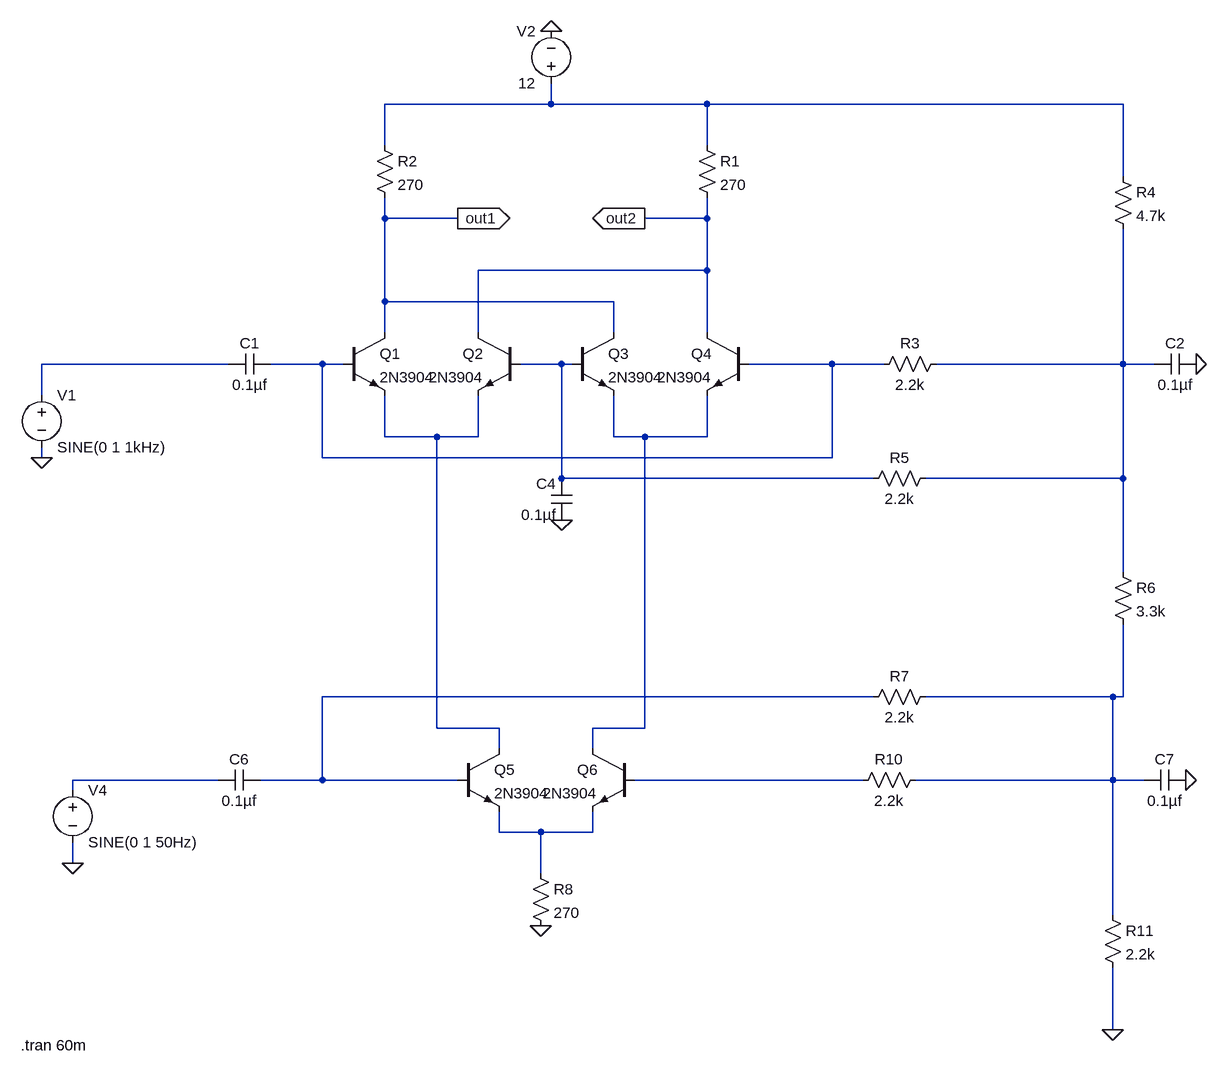
[diagram p0: schematic Day10_Gilbert_Cell_Multiplier.asc]
Day10_Gilbert_Cell_Multiplier.asc, the LTspice schematic file:
Version 4.1
SHEET 1 1396 1256
WIRE 384 -208 384 -240
WIRE 384 -208 128 -208
WIRE 624 -208 384 -208
WIRE 1264 -208 624 -208
WIRE 128 -144 128 -208
WIRE 624 -144 624 -208
WIRE 1264 -96 1264 -208
WIRE 128 -32 128 -64
WIRE 240 -32 128 -32
WIRE 624 -32 624 -64
WIRE 624 -32 528 -32
WIRE 624 48 624 -32
WIRE 624 48 272 48
WIRE 128 96 128 -32
WIRE 480 96 128 96
WIRE 128 144 128 96
WIRE 272 144 272 48
WIRE 480 144 480 96
WIRE 624 144 624 48
WIRE -112 192 -400 192
WIRE 32 192 -48 192
WIRE 64 192 32 192
WIRE 400 192 336 192
WIRE 416 192 400 192
WIRE 816 192 688 192
WIRE 896 192 816 192
WIRE 1264 192 1264 -16
WIRE 1264 192 976 192
WIRE 1312 192 1264 192
WIRE -400 240 -400 192
WIRE 128 304 128 240
WIRE 208 304 128 304
WIRE 272 304 272 240
WIRE 272 304 208 304
WIRE 480 304 480 240
WIRE 528 304 480 304
WIRE 624 304 624 240
WIRE 624 304 528 304
WIRE -400 336 -400 320
WIRE 32 336 32 192
WIRE 816 336 816 192
WIRE 816 336 32 336
WIRE 400 368 400 192
WIRE 880 368 400 368
WIRE 1264 368 1264 192
WIRE 1264 368 960 368
WIRE 1264 512 1264 368
WIRE 880 704 32 704
WIRE 1248 704 960 704
WIRE 1264 704 1264 592
WIRE 1264 704 1248 704
WIRE 208 752 208 304
WIRE 304 752 208 752
WIRE 528 752 528 304
WIRE 528 752 448 752
WIRE 304 784 304 752
WIRE 448 784 448 752
WIRE -128 832 -352 832
WIRE 32 832 32 704
WIRE 32 832 -64 832
WIRE 240 832 32 832
WIRE 864 832 512 832
WIRE 1248 832 1248 704
WIRE 1248 832 944 832
WIRE 1296 832 1248 832
WIRE -352 848 -352 832
WIRE 304 912 304 880
WIRE 368 912 304 912
WIRE 448 912 448 880
WIRE 448 912 368 912
WIRE -352 960 -352 928
WIRE 368 976 368 912
WIRE 1248 1040 1248 832
WIRE 1248 1216 1248 1120
FLAG 384 -320 0
FLAG -400 336 0
FLAG 1376 192 0
FLAG -352 960 0
FLAG 368 1056 0
FLAG 1360 832 0
FLAG 1248 1216 0
FLAG 400 432 0
FLAG 240 -32 out1
IOPIN 240 -32 Out
FLAG 528 -32 out2
IOPIN 528 -32 Out
SYMBOL npn 64 144 R0
SYMATTR InstName Q1
SYMATTR Value 2N3904
SYMBOL npn 336 144 M0
SYMATTR InstName Q2
SYMATTR Value 2N3904
SYMBOL npn 416 144 R0
SYMATTR InstName Q3
SYMATTR Value 2N3904
SYMBOL npn 688 144 M0
SYMATTR InstName Q4
SYMATTR Value 2N3904
SYMBOL cap -48 176 R90
WINDOW 0 0 32 VBottom 2
WINDOW 3 32 32 VTop 2
SYMATTR InstName C1
SYMATTR Value 0.1µf
SYMBOL voltage -400 224 R0
WINDOW 123 0 0 Left 0
WINDOW 39 0 0 Left 0
SYMATTR InstName V1
SYMATTR Value SINE(0 1 1kHz)
SYMBOL res 608 -160 R0
SYMATTR InstName R1
SYMATTR Value 270
SYMBOL res 112 -160 R0
SYMATTR InstName R2
SYMATTR Value 270
SYMBOL voltage 384 -224 R180
WINDOW 0 24 96 Left 2
WINDOW 3 24 16 Left 2
WINDOW 123 0 0 Left 0
WINDOW 39 0 0 Left 0
SYMATTR InstName V2
SYMATTR Value 12
SYMBOL res 992 176 R90
WINDOW 0 0 56 VBottom 2
WINDOW 3 32 56 VTop 2
SYMATTR InstName R3
SYMATTR Value 2.2k
SYMBOL res 1248 -112 R0
SYMATTR InstName R4
SYMATTR Value 4.7k
SYMBOL cap 1376 176 R90
WINDOW 0 0 32 VBottom 2
WINDOW 3 32 32 VTop 2
SYMATTR InstName C2
SYMATTR Value 0.1µf
SYMBOL res 976 352 R90
WINDOW 0 0 56 VBottom 2
WINDOW 3 32 56 VTop 2
SYMATTR InstName R5
SYMATTR Value 2.2k
SYMBOL cap -64 816 R90
WINDOW 0 0 32 VBottom 2
WINDOW 3 32 32 VTop 2
SYMATTR InstName C6
SYMATTR Value 0.1µf
SYMBOL voltage -352 832 R0
WINDOW 123 0 0 Left 0
WINDOW 39 0 0 Left 0
SYMATTR InstName V4
SYMATTR Value SINE(0 1 50Hz)
SYMBOL res 960 816 R90
WINDOW 0 0 56 VBottom 2
WINDOW 3 32 56 VTop 2
SYMATTR InstName R10
SYMATTR Value 2.2k
SYMBOL cap 1360 816 R90
WINDOW 0 0 32 VBottom 2
WINDOW 3 32 32 VTop 2
SYMATTR InstName C7
SYMATTR Value 0.1µf
SYMBOL res 1232 1024 R0
SYMATTR InstName R11
SYMATTR Value 2.2k
SYMBOL res 976 688 R90
WINDOW 0 0 56 VBottom 2
WINDOW 3 32 56 VTop 2
SYMATTR InstName R7
SYMATTR Value 2.2k
SYMBOL npn 240 784 R0
SYMATTR InstName Q5
SYMATTR Value 2N3904
SYMBOL npn 512 784 M0
SYMATTR InstName Q6
SYMATTR Value 2N3904
SYMBOL cap 416 432 R180
WINDOW 0 24 56 Left 2
WINDOW 3 24 8 Left 2
SYMATTR InstName C4
SYMATTR Value 0.1µf
SYMBOL res 1248 496 R0
SYMATTR InstName R6
SYMATTR Value 3.3k
SYMBOL res 352 960 R0
SYMATTR InstName R8
SYMATTR Value 270
TEXT -432 1240 Left 2 !.tran 60m

The netlist it stands for:
* Day10_Gilbert_Cell_Multiplier.asc
Q1 out1 N003 N006 0 2N3904
Q2 out2 N004 N006 0 2N3904
Q3 out1 N004 N007 0 2N3904
Q4 out2 N003 N007 0 2N3904
C1 N003 N002 0.1µf
V1 N002 0 SINE(0 1 1kHz)
R1 N001 out2 270
R2 N001 out1 270
V2 N001 0 12
R3 N005 N003 2.2k
R4 N001 N005 4.7k
C2 0 N005 0.1µf
R5 N005 N004 2.2k
C6 N008 N010 0.1µf
V4 N010 0 SINE(0 1 50Hz)
R10 N009 N011 2.2k
C7 0 N009 0.1µf
R11 N009 0 2.2k
R7 N009 N008 2.2k
Q5 N006 N008 N012 0 2N3904
Q6 N007 N011 N012 0 2N3904
C4 0 N004 0.1µf
R6 N005 N009 3.3k
R8 N012 0 270
.model NPN NPN
.model PNP PNP
.lib standard.bjt
.tran 60m
.backanno
.end